# Altium schematic sheet 1_uC.SchDoc
size 414 x 293 mm; SheetNumber: 1; SheetTotal: 4
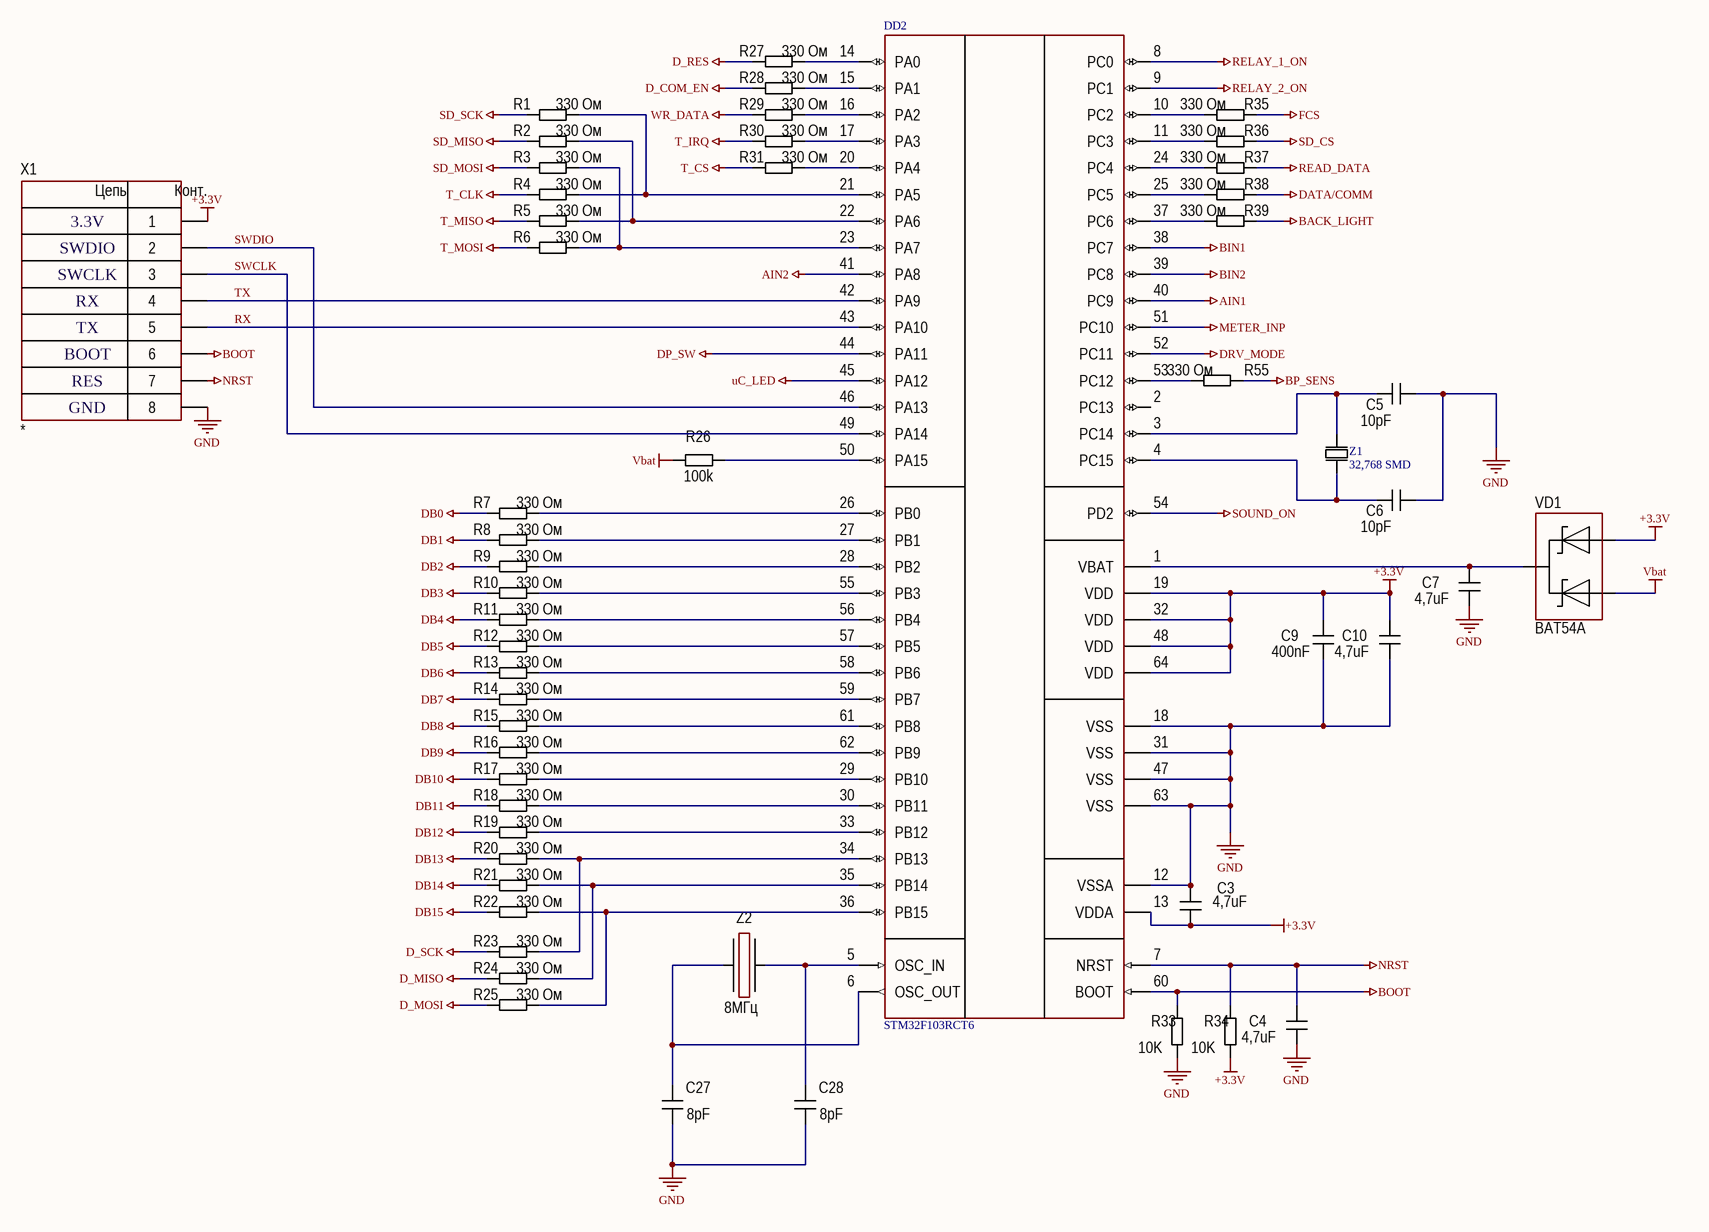
[diagram p0: 1_uC.SchDoc]

## Parts
C3  4,7uF  [CH0402C]
C4  4,7uF  [CH0402C]
C5  10pF  [CH0402C]
C6  10pF  [CH0402C]
C7  4,7uF  [CH0402C]
C9  400nF  [CH0402C]
C10  4,7uF  [CH0402C]
C27  8pF  [CH0402C]
C28  8pF  [CH0402C]
DD2  STM32F103RCT6  [64-LQFP]
R1  330 Ом  [CH0603R]
R2  330 Ом  [CH0603R]
R3  330 Ом  [CH0603R]
R4  330 Ом  [CH0603R]
R5  330 Ом  [CH0603R]
R6  330 Ом  [CH0603R]
R7  330 Ом  [CH0603R]
R8  330 Ом  [CH0603R]
R9  330 Ом  [CH0603R]
R10  330 Ом  [CH0603R]
R11  330 Ом  [CH0603R]
R12  330 Ом  [CH0603R]
R13  330 Ом  [CH0603R]
R14  330 Ом  [CH0603R]
R15  330 Ом  [CH0603R]
R16  330 Ом  [CH0603R]
R17  330 Ом  [CH0603R]
R18  330 Ом  [CH0603R]
R19  330 Ом  [CH0603R]
R20  330 Ом  [CH0603R]
R21  330 Ом  [CH0603R]
R22  330 Ом  [CH0603R]
R23  330 Ом  [CH0603R]
R24  330 Ом  [CH0603R]
R25  330 Ом  [CH0603R]
R26  100k  [CH0603R]
R27  330 Ом  [CH0603R]
R28  330 Ом  [CH0603R]
R29  330 Ом  [CH0603R]
R30  330 Ом  [CH0603R]
R31  330 Ом  [CH0603R]
R33  10K  [CH0805R]
R34  10K  [CH0805R]
R35  330 Ом  [CH0603R]
R36  330 Ом  [CH0603R]
R37  330 Ом  [CH0603R]
R38  330 Ом  [CH0603R]
R39  330 Ом  [CH0603R]
R55  330 Ом  [CH0603R]
VD1  BAT54A  [SOT23_123]
X1  *  [CON: PLS-8]
Z1  32,768 SMD  [SMD 32.768KHz]
Z2  8МГц  [OSC: ABM3]

## Nets
+3.3V: C3.1 C9.1 C10.2 DD2.13(VDDA) DD2.19(VDD) DD2.32(VDD) DD2.48(VDD) DD2.64(VDD) R34.1 VD1.1 X1.1
AIN1: DD2.40(PC9)
AIN2: DD2.41(PA8)
BACK_LIGHT: R39.1
BIN1: DD2.38(PC7)
BIN2: DD2.39(PC8)
BOOT: DD2.60(BOOT) R33.2 X1.6
BP_SENS: R55.1
D_COM_EN: R28.1
D_MISO: R24.1
D_MOSI: R25.1
D_RES: R27.1
D_SCK: R23.1
DATA/COMM: R38.1
DB0: R7.1
DB1: R8.1
DB2: R9.1
DB3: R10.1
DB4: R11.1
DB5: R12.1
DB6: R13.1
DB7: R14.1
DB8: R15.1
DB9: R16.1
DB10: R17.1
DB11: R18.1
DB12: R19.1
DB13: R20.1
DB14: R21.1
DB15: R22.1
DP_SW: DD2.44(PA11)
DRV_MODE: DD2.52(PC11)
FCS: R35.1
GND: C3.2 C4.1 C5.2 C6.1 C7.1 C9.2 C10.1 C27.1 C28.1 DD2.12(VSSA) DD2.18(VSS) DD2.31(VSS) DD2.47(VSS) DD2.63(VSS) R33.1 X1.8
METER_INP: DD2.51(PC10)
NRST: C4.2 DD2.7(NRST) R34.2 X1.7
READ_DATA: R37.1
RELAY_1_ON: DD2.8(PC0)
RELAY_2_ON: DD2.9(PC1)
SD_CS: R36.1
SD_MISO: R2.1
SD_MOSI: R3.1
SD_SCK: R1.1
SOUND_ON: DD2.54(PD2)
T_CLK: R4.1
T_CS: R31.1
T_IRQ: R30.1
T_MISO: R5.1
T_MOSI: R6.1
uC_LED: DD2.45(PA12)
Vbat: R26.1 VD1.3
WR_DATA: R29.1
RX: DD2.43(PA10) X1.5
SWCLK: DD2.49(PA14) X1.3
SWDIO: DD2.46(PA13) X1.2
TX: DD2.42(PA9) X1.4
NetC5_1: C5.1 DD2.3(PC14) Z1.1
NetC6_2: C6.2 DD2.4(PC15) Z1.2
NetC7_2: C7.2 DD2.1(VBAT) VD1.2
NetC27_2: C27.2 DD2.6(OSC_OUT) Z2.1
NetC28_2: C28.2 DD2.5(OSC_IN) Z2.3
NetDD2_10: DD2.10(PC2) R35.2
NetDD2_11: DD2.11(PC3) R36.2
NetDD2_14: DD2.14(PA0) R27.2
NetDD2_15: DD2.15(PA1) R28.2
NetDD2_16: DD2.16(PA2) R29.2
NetDD2_17: DD2.17(PA3) R30.2
NetDD2_20: DD2.20(PA4) R31.2
NetDD2_21: DD2.21(PA5) R1.2 R4.2
NetDD2_22: DD2.22(PA6) R2.2 R5.2
NetDD2_23: DD2.23(PA7) R3.2 R6.2
NetDD2_24: DD2.24(PC4) R37.2
NetDD2_25: DD2.25(PC5) R38.2
NetDD2_26: DD2.26(PB0) R7.2
NetDD2_27: DD2.27(PB1) R8.2
NetDD2_28: DD2.28(PB2) R9.2
NetDD2_29: DD2.29(PB10) R17.2
NetDD2_30: DD2.30(PB11) R18.2
NetDD2_33: DD2.33(PB12) R19.2
NetDD2_34: DD2.34(PB13) R20.2 R23.2
NetDD2_35: DD2.35(PB14) R21.2 R24.2
NetDD2_36: DD2.36(PB15) R22.2 R25.2
NetDD2_37: DD2.37(PC6) R39.2
NetDD2_50: DD2.50(PA15) R26.2
NetDD2_53: DD2.53(PC12) R55.2
NetDD2_55: DD2.55(PB3) R10.2
NetDD2_56: DD2.56(PB4) R11.2
NetDD2_57: DD2.57(PB5) R12.2
NetDD2_58: DD2.58(PB6) R13.2
NetDD2_59: DD2.59(PB7) R14.2
NetDD2_61: DD2.61(PB8) R15.2
NetDD2_62: DD2.62(PB9) R16.2

Not connected (* = marked no-connect by the designer): DD2 2(PC13)

## Notes on the sheet
- 3.3V
- SWDIO
- SWCLK
- RX
- TX
- BOOT
- RES
- GND
- Изм.
- Лист
- № докум.
- Подпись
- Дата
- Лит.
- Масса
- Масштаб
- Пров.
- Разраб.
- Т. контр.
- Н. контр.
- Листов
- Утв.
- (in symbol 8-Connector) Цепь; Конт.

## Library data of the parts
C3-C6 C9 C10 C27 C28 = Capacitor: 0402; Manufacturer: *; Model: *; HelpURL: *; ComponentKind: *; Value: *
C7 = Capacitor: Manufacturer: *; Model: *; HelpURL: *; ComponentKind: *; Value: *
DD2 = STM32F103RCT6: Cortex-M3 (64-LQFP)
R1-R31 R35-R39 R55 = Resistor: 0603; Manufacturer: *; Model: *; HelpURL: *; ComponentKind: *; Value: *
R33 R34 = Resistor: 0805; Manufacturer: *; Model: *; HelpURL: *; ComponentKind: *; Value: *
VD1 = Diod Schottky Array v.1: SOT-23; ComponentKind: *; Manufacturer: *; Model: *; HelpURL: *
X1 = 8-Connector: Pin header 8; Model: *; Manufacturer: *; HelpURL: *; ComponentKind: *
Z1 = Kvarc_32,768: 32,768 kHz SMD 8mm x 3.8mm 12,5pF
Z2 = Oscillator: NX5032GA-8MHz; Manufacturer: *; Model: *; HelpURL: *; ComponentKind: *; Value: *